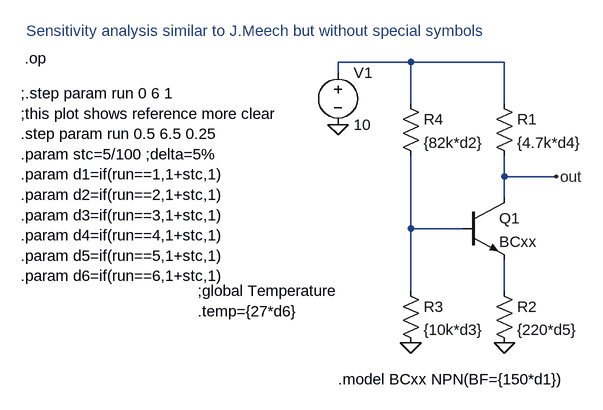
[diagram p0: schematic Gerds_sensitivity_analysis.asc]
Gerds_sensitivity_analysis.asc, the LTspice schematic file:
Version 4
SHEET 1 1132 680
WIRE 208 -80 208 -96
WIRE 320 -96 208 -96
WIRE 320 -32 320 -96
WIRE 320 160 320 48
WIRE 320 256 320 160
WIRE 400 160 320 160
WIRE 464 -96 320 -96
WIRE 464 -32 464 -96
WIRE 464 80 464 48
WIRE 464 112 464 80
WIRE 464 256 464 208
WIRE 544 80 464 80
FLAG 464 336 0
FLAG 320 336 0
FLAG 544 80 out
FLAG 208 0 0
SYMBOL npn 400 112 R0
SYMATTR InstName Q1
SYMATTR Value BCxx
SYMBOL res 448 -48 R0
SYMATTR InstName R1
SYMATTR Value {4.7k*d4}
SYMBOL res 448 240 R0
SYMATTR InstName R2
SYMATTR Value {220*d5}
SYMBOL res 304 240 R0
SYMATTR InstName R3
SYMATTR Value {10k*d3}
SYMBOL res 304 -48 R0
SYMATTR InstName R4
SYMATTR Value {82k*d2}
SYMBOL voltage 208 -96 R0
WINDOW 123 0 0 Left 0
WINDOW 39 0 0 Left 0
SYMATTR InstName V1
SYMATTR Value 10
TEXT -274 -102 Left 0 !.op
TEXT -280 -48 Left 0 !;.step param run 0 6 1\n;this plot shows reference more clear\n.step param run 0.5 6.5 0.25\n.param stc=5/100 ;delta=5%\n.param d1=if(run==1,1+stc,1)\n.param d2=if(run==2,1+stc,1)\n.param d3=if(run==3,1+stc,1)\n.param d4=if(run==4,1+stc,1)\n.param d5=if(run==5,1+stc,1)\n.param d6=if(run==6,1+stc,1)
TEXT 208 392 Left 0 !.model BCxx NPN(BF={150*d1})
TEXT -8 256 Left 0 !;global Temperature\n.temp={27*d6}
TEXT -272 -144 Left 0 ;Sensitivity analysis similar to J.Meech but without special symbols

The netlist it stands for:
* Gerds_sensitivity_analysis.asc
Q1 out N002 N003 0 BCxx
R1 N001 out {4.7k*d4}
R2 N003 0 {220*d5}
R3 N002 0 {10k*d3}
R4 N001 N002 {82k*d2}
V1 N001 0 10
.model NPN NPN
.model PNP PNP
.lib standard.bjt
.op
;.step param run 0 6 1
;this plot shows reference more clear
.step param run 0.5 6.5 0.25
.param stc=5/100 ;delta=5%
.param d1=if(run==1,1+stc,1)
.param d2=if(run==2,1+stc,1)
.param d3=if(run==3,1+stc,1)
.param d4=if(run==4,1+stc,1)
.param d5=if(run==5,1+stc,1)
.param d6=if(run==6,1+stc,1)
.model BCxx NPN(BF={150*d1})
;global Temperature
.temp={27*d6}
* Sensitivity analysis similar to J.Meech but without special symbols
.backanno
.end